# Altium schematic sheet SPD Programmer.SchDoc
size A3
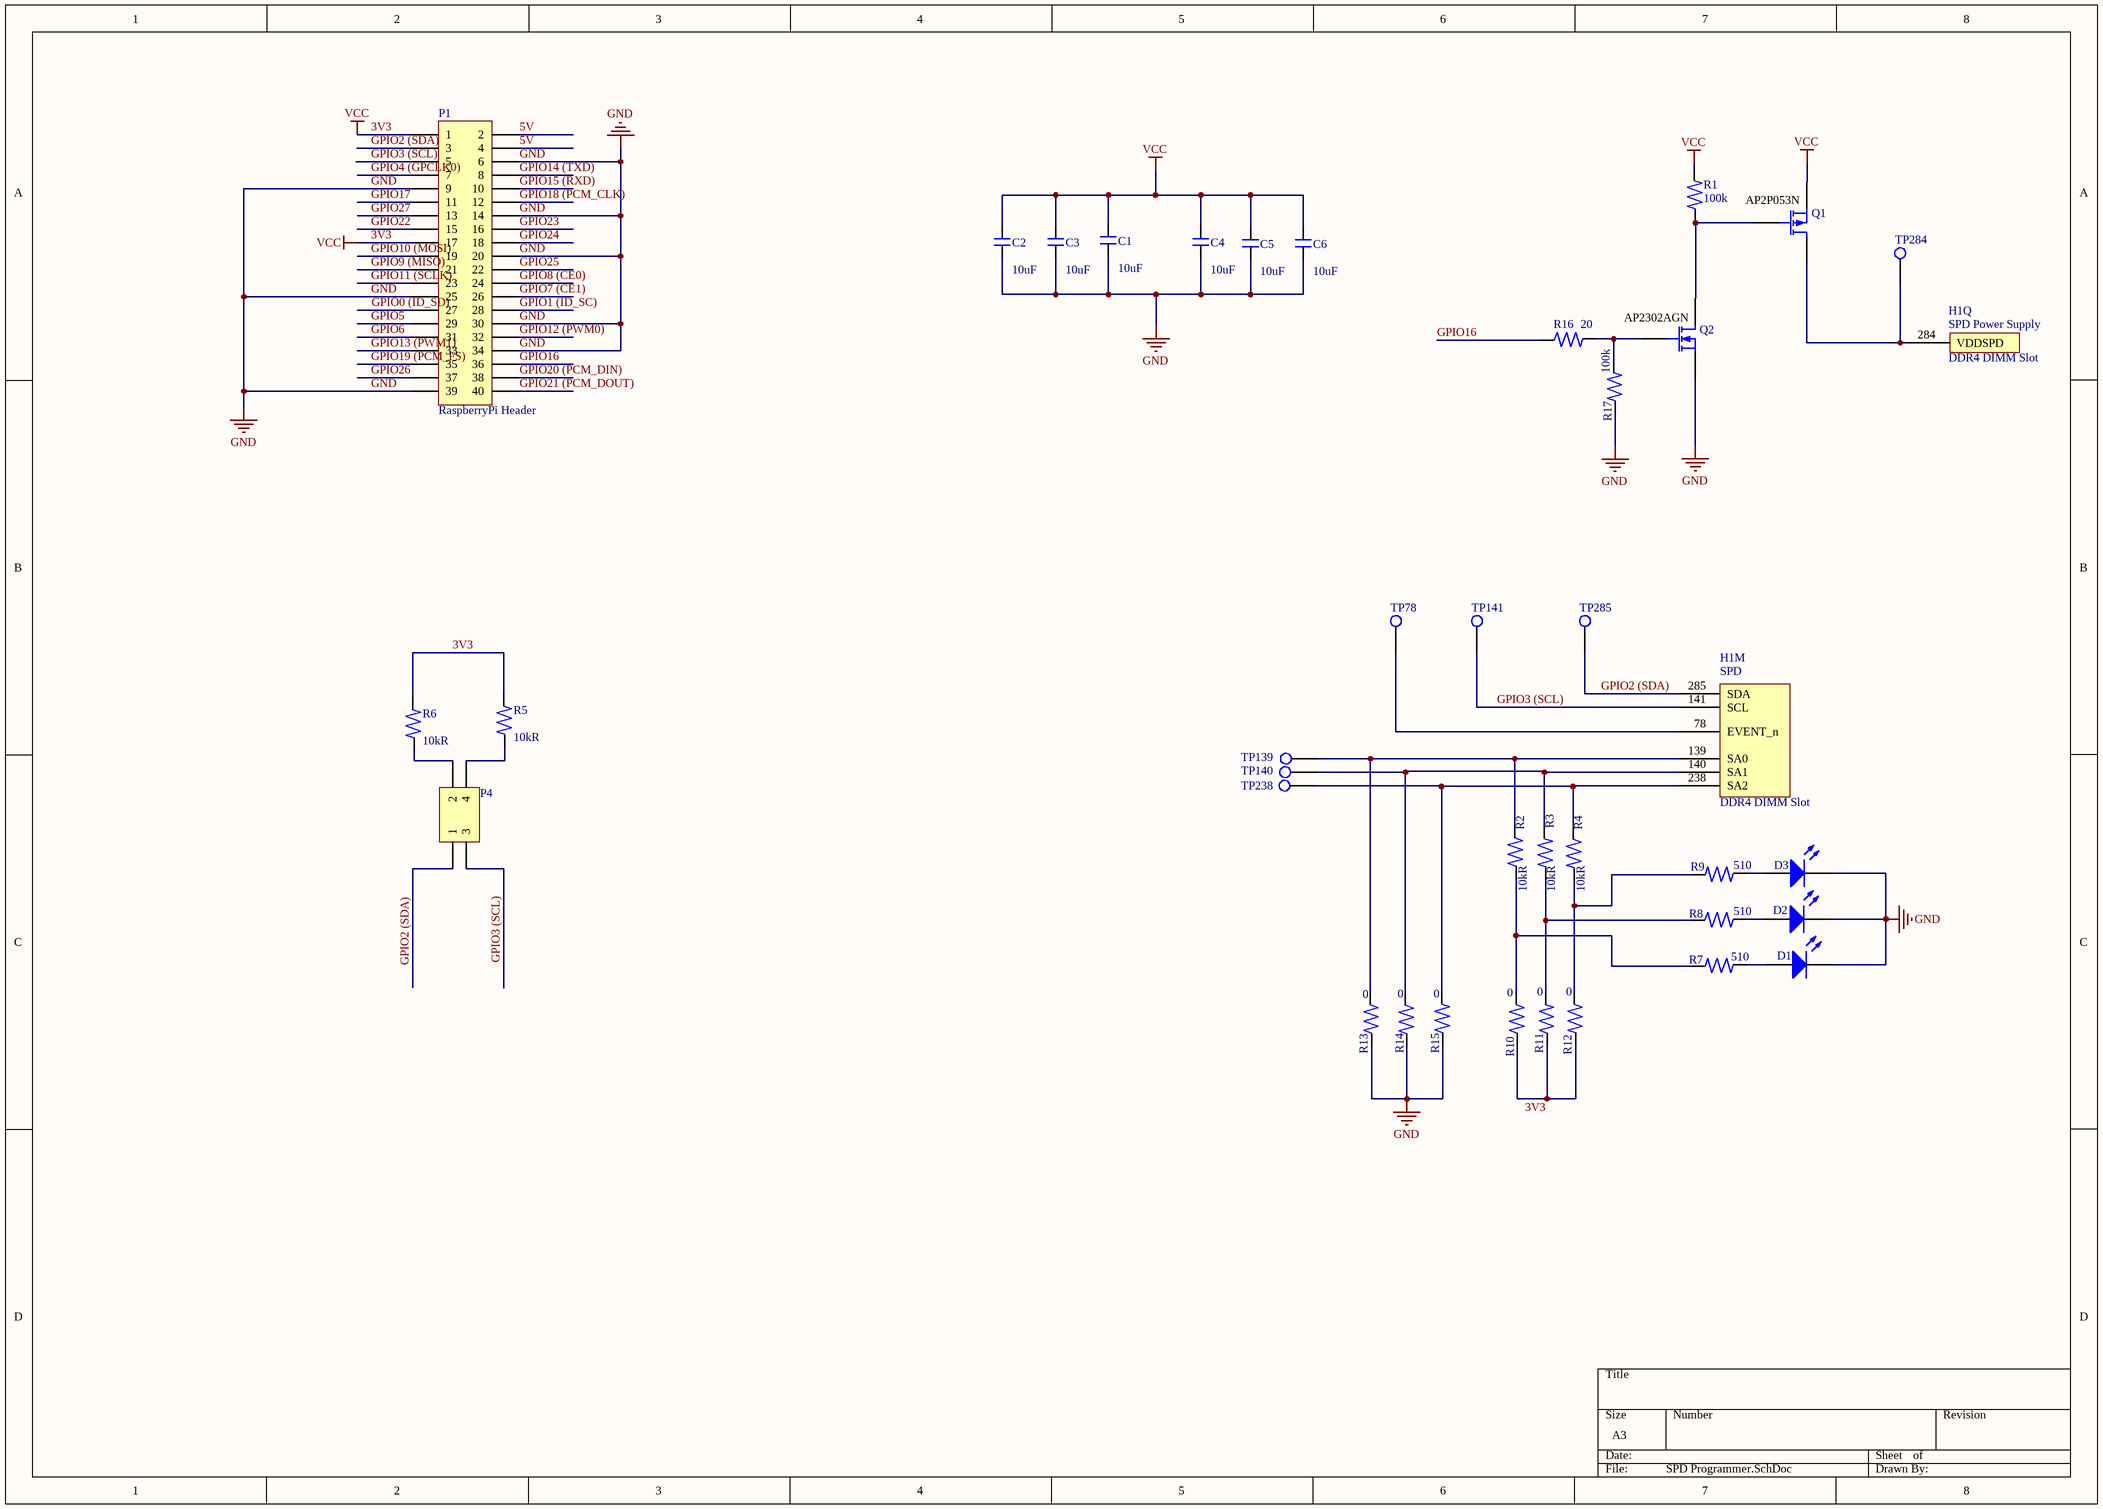
[diagram p0: SPD Programmer.SchDoc]

## Parts
C1  Capacitance: 10uF  [Capacitor 0603]  (hidden comment: Capacitor 0603)
C2  Capacitance: 10uF  [Capacitor 0603]  (hidden comment: Capacitor 0603)
C3  Capacitance: 10uF  [Capacitor 0603]  (hidden comment: Capacitor 0603)
C4  Capacitance: 10uF  [Capacitor 0603]  (hidden comment: Capacitor 0603)
C5  Capacitance: 10uF  [Capacitor 0603]  (hidden comment: Capacitor 0603)
C6  Capacitance: 10uF  [Capacitor 0603]  (hidden comment: Capacitor 0603)
D1  LED2  [3.2X1.6X1.1]  (value not drawn)
D2  LED2  [3.2X1.6X1.1]  (value not drawn)
D3  LED2  [3.2X1.6X1.1]  (value not drawn)
H1  DDR4 DIMM Slot  [DDR4 DIMM Slot]  (parts M,Q of 21)
P1  RaspberryPi Header  [HDR2X20]
P4  Header 2X2  [HDR2X2]  (value not drawn)
Q1  MOSFET-P  [SOT23]  (value not drawn)
Q2  MOSFET-N  [SOT23]  (value not drawn)
R1  Resistance: 100k  [Resistor 0603]  (hidden comment: Resistor 0603)
R2  Resistance: 10kR  [Resistor 0603]  (hidden comment: Resistor 0603)
R3  Resistance: 10kR  [Resistor 0603]  (hidden comment: Resistor 0603)
R4  Resistance: 10kR  [Resistor 0603]  (hidden comment: Resistor 0603)
R5  Resistance: 10kR  [Resistor 0603]  (hidden comment: Resistor 0603)
R6  Resistance: 10kR  [Resistor 0603]  (hidden comment: Resistor 0603)
R7  Resistance: 510  [Resistor 0603]  (hidden comment: Resistor 0603)
R8  Resistance: 510  [Resistor 0603]  (hidden comment: Resistor 0603)
R9  Resistance: 510  [Resistor 0603]  (hidden comment: Resistor 0603)
R10  Resistance: 0  [Resistor 0603]  (hidden comment: Resistor 0603)
R11  Resistance: 0  [Resistor 0603]  (hidden comment: Resistor 0603)
R12  Resistance: 0  [Resistor 0603]  (hidden comment: Resistor 0603)
R13  Resistance: 0  [Resistor 0603]  (hidden comment: Resistor 0603)
R14  Resistance: 0  [Resistor 0603]  (hidden comment: Resistor 0603)
R15  Resistance: 0  [Resistor 0603]  (hidden comment: Resistor 0603)
R16  Resistance: 20  [Resistor 0603]  (hidden comment: Resistor 0603)
R17  Resistance: 100k  [Resistor 0603]  (hidden comment: Resistor 0603)
TP78  Test Point  [Test Point]  (value not drawn)
TP139  Test Point  [Test Point]  (value not drawn)
TP140  Test Point  [Test Point]  (value not drawn)
TP141  Test Point  [Test Point]  (value not drawn)
TP238  Test Point  [Test Point]  (value not drawn)
TP284  Test Point  [Test Point]  (value not drawn)
TP285  Test Point  [Test Point]  (value not drawn)

## Nets
3V3: C1.2 C2.2 C3.2 C4.2 C5.2 C6.2 P1.1 P1.17 Q1.2(S) R1.2 R5.2 R6.2 R10.2 R11.2 R12.2  [also labelled VCC]
GND: C1.1 C2.1 C3.1 C4.1 C5.1 C6.1 D1.2(K) D2.2(K) D3.2(K) P1.6 P1.9 P1.14 P1.20 P1.25 P1.30 P1.34 P1.39 Q2.2(S) R13.2 R14.2 R15.2 R17.2
5V: P1.2 P1.4
GPIO0 (ID_SD): P1.27
GPIO1 (ID_SC): P1.28
GPIO2 (SDA): H1.285(SDA) P1.3 P4.1 TP285.1
GPIO3 (SCL): H1.141(SCL) P1.5 P4.3 TP141.1
GPIO4 (GPCLK0): P1.7
GPIO5: P1.29
GPIO6: P1.31
GPIO7 (CE1): P1.26
GPIO8 (CE0): P1.24
GPIO9 (MISO): P1.21
GPIO10 (MOSI): P1.19
GPIO11 (SCLK): P1.23
GPIO12 (PWM0): P1.32
GPIO13 (PWM1): P1.33
GPIO14 (TXD): P1.8
GPIO15 (RXD): P1.10
GPIO16: P1.36 R16.1
GPIO17: P1.11
GPIO18 (PCM_CLK): P1.12
GPIO19 (PCM_FS): P1.35
GPIO20 (PCM_DIN): P1.38
GPIO21 (PCM_DOUT): P1.40
GPIO22: P1.15
GPIO23: P1.16
GPIO24: P1.18
GPIO25: P1.22
GPIO26: P1.37
GPIO27: P1.13
NetD1_1: D1.1(A) R7.1
NetD2_1: D2.1(A) R8.1
NetD3_1: D3.1(A) R9.2
NetH1_78: H1.78(EVENT_n) TP78.1
NetH1_139: H1.139(SA0) R2.2 R13.1 TP139.1
NetH1_140: H1.140(SA1) R3.2 R14.1 TP140.1
NetH1_238: H1.238(SA2) R4.2 R15.1 TP238.1
NetH1_284: H1.284(VDDSPD) Q1.3(D) TP284.1
NetP4_2: P4.2 R6.1
NetP4_4: P4.4 R5.1
NetQ1_1: Q1.1(G) Q2.3(D) R1.1
NetQ2_1: Q2.1(G) R16.2 R17.1
NetR2_1: R2.1 R7.2 R10.1
NetR3_1: R3.1 R8.2 R11.1
NetR4_1: R4.1 R9.1 R12.1

## Notes on the sheet
- (near Q1) AP2P053N
- (near Q2) AP2302AGN
- (in symbol DDR4 DIMM Slot, part M) SPD
- (in symbol DDR4 DIMM Slot, part Q) SPD Power Supply

## Library data of the parts
C1-C6 = Capacitor 0603: Manufacturer: Vishay; Manufacturer Part Number: CRCW060310K0FKEA; Max Power Dissipation: 100mW; Tolerance: 1%; Voltage Rating: 75V; Temperature Coefficient: 100ppm/°C; Supplier 1: Avnet Europe; Stock 1: 305000; Pricing 1: 5000=0.00444, 10000=0.00432, 20000=0.00421, 30000=0.0041, 40000=0.004 (EUR); Case/Package: 0603; Number of Pins: 2; Weight: 7.1E-05oz; Contact Plating: Tin,Lead; Case Code (Metric): 1608; Case Code (Imperial): 0603; Min Operating Temperature: -55°C; Max Operating Temperature: 155°C; Packaging: Tape and Reel; Package Quantity: 10; Termination: SMD/SMT; Power Rating: 100mW; Composition: Thick Film; Number of Terminations: 2; Military Standard: Not; Voltage Rating (DC): 75V; Features: Automotive AEC-Q200; Length: 1.55mm; Height: 0.45mm; Width: 0.033inch; Depth: 0.85mm; Radiation Hardening: No; REACH SVHC: Unknown; Lead Free: Lead Free
D1-D3 = LED2: Typical RED, GREEN, YELLOW, AMBER GaAs LED; Published: 8-Jun-2000; LatestRevisionDate: 17-Jul-2002; LatestRevisionNote: Re-released for DXP Platform.; PackageVersion: Feb-2002; PackageReference: 3.2X1.6X1.1; Publisher: Altium Limited; PackageDescription: SM LED; 2 Flat Leads
P1 = Header 20X2: Header, 20-Pin, Dual row; LatestRevisionDate: 17-Jul-2002; LatestRevisionNote: Re-released for DXP Platform.; Publisher: Altium Limited
P4 = Header 2X2: Header, 2-Pin, Dual row; LatestRevisionDate: 17-Jul-2002; LatestRevisionNote: Re-released for DXP Platform.; Publisher: Altium Limited
Q1 = PMOS
Q2 = NMOS: Published: 8-Jun-2000; LatestRevisionDate: 17-Jul-2002; LatestRevisionNote: Re-released for DXP Platform.; PackageVersion: 1995/1996; PackageReference: E3; Publisher: Altium Limited; PackageDescription: TO, Flat Index; 3 In-Line, Axial Leads; Body Dia. 4.6mm; Lead Dia. 0.5 mm (max)
R1-R17 = Resistor 0603: Manufacturer: Vishay; Manufacturer Part Number: CRCW060310K0FKEA; Max Power Dissipation: 100mW; Tolerance: 1%; Voltage Rating: 75V; Temperature Coefficient: 100ppm/°C; Supplier 1: Avnet Europe; Stock 1: 305000; Pricing 1: 5000=0.00444, 10000=0.00432, 20000=0.00421, 30000=0.0041, 40000=0.004 (EUR); Case/Package: 0603; Number of Pins: 2; Weight: 7.1E-05oz; Contact Plating: Tin,Lead; Case Code (Metric): 1608; Case Code (Imperial): 0603; Min Operating Temperature: -55°C; Max Operating Temperature: 155°C; Packaging: Tape and Reel; Package Quantity: 10; Termination: SMD/SMT; Power Rating: 100mW; Composition: Thick Film; Number of Terminations: 2; Military Standard: Not; Voltage Rating (DC): 75V; Features: Automotive AEC-Q200; Length: 1.55mm; Height: 0.45mm; Width: 0.033inch; Depth: 0.85mm; Radiation Hardening: No; REACH SVHC: Unknown; Lead Free: Lead Free; ComponentLink1URL: http://www.vishay.com/docs/20008/dcrcw.pdf?src-supplier=Avnet+Europe; ComponentLink1Description: http://www.vishay.com/docs/20008/dcrcw.pdf?src-supplier=Avnet+Europe; ComponentLink2URL: https://www.verical.com/server-webapp/html/getDatasheet?partID=86831&src-supplier=Verical; ComponentLink2Description: https://www.verical.com/server-webapp/html/getDatasheet?partID=86831&src-supplier=Verical; ComponentLink3URL: http://www.farnell.com/datasheets/2310790.pdf?src-supplier=Allied+Electronics; ComponentLink3Description: http://www.farnell.com/datasheets/2310790.pdf?src-supplier=Allied+Electronics; ComponentLink4URL: http://www.vishay.com/docs/20035/dcrcwe3.pdf?src-supplier=Digi-Key; ComponentLink4Description: http://www.vishay.com/docs/20035/dcrcwe3.pdf?src-supplier=Digi-Key; ComponentLink5URL: http://www.farnell.com/datasheets/2310790.pdf?src-supplier=Mouser; ComponentLink5Description: http://www.farnell.com/datasheets/2310790.pdf?src-supplier=Mouser; ComponentLink6URL: http://www.farnell.com/datasheets/2310790.pdf?src-supplier=Element14; ComponentLink6Description: http://www.farnell.com/datasheets/2310790.pdf?src-supplier=Element14; ComponentLink7URL: http://www.farnell.com/datasheets/2310790.pdf?src-supplier=Avnet; ComponentLink7Description: http://www.farnell.com/datasheets/2310790.pdf?src-supplier=Avnet; ComponentLink8URL: http://www.vishay.com/docs/20035/dcrcwe3.pdf?src-supplier=Future+Electronics; ComponentLink8Description: http://www.vishay.com/docs/20035/dcrcwe3.pdf?src-supplier=Future+Electronics; ComponentLink9URL: http://uk.rs-online.com/webdocs/0d98/0900766b80d98afc.pdf?src-supplier=RSComponents; ComponentLink9Description: http://uk.rs-online.com/webdocs/0d98/0900766b80d98afc.pdf?src-supplier=RSComponents; ComponentLink10URL: http://www.farnell.com/datasheets/2310790.pdf?src-supplier=Distrelec; ComponentLink10Description: http://www.farnell.com/datasheets/2310790.pdf?src-supplier=Distrelec